# Altium schematic sheet FMC_SFP_ADAPTER_SFP.SchDoc: SFP Connector and case, power supply filtering and status flags, 125 MHz clock
size A4; Date: 10.03.2021; DrawnBy: PFH; Engineer: PFH; DocumentNumber: 1; Revision: A; SheetNumber: 2; SheetTotal: 2; Projekt: FMC-to-SFP Adapter; Website: www.fmchub.com; ProjectName: FMC_Single_LPC_Commercial
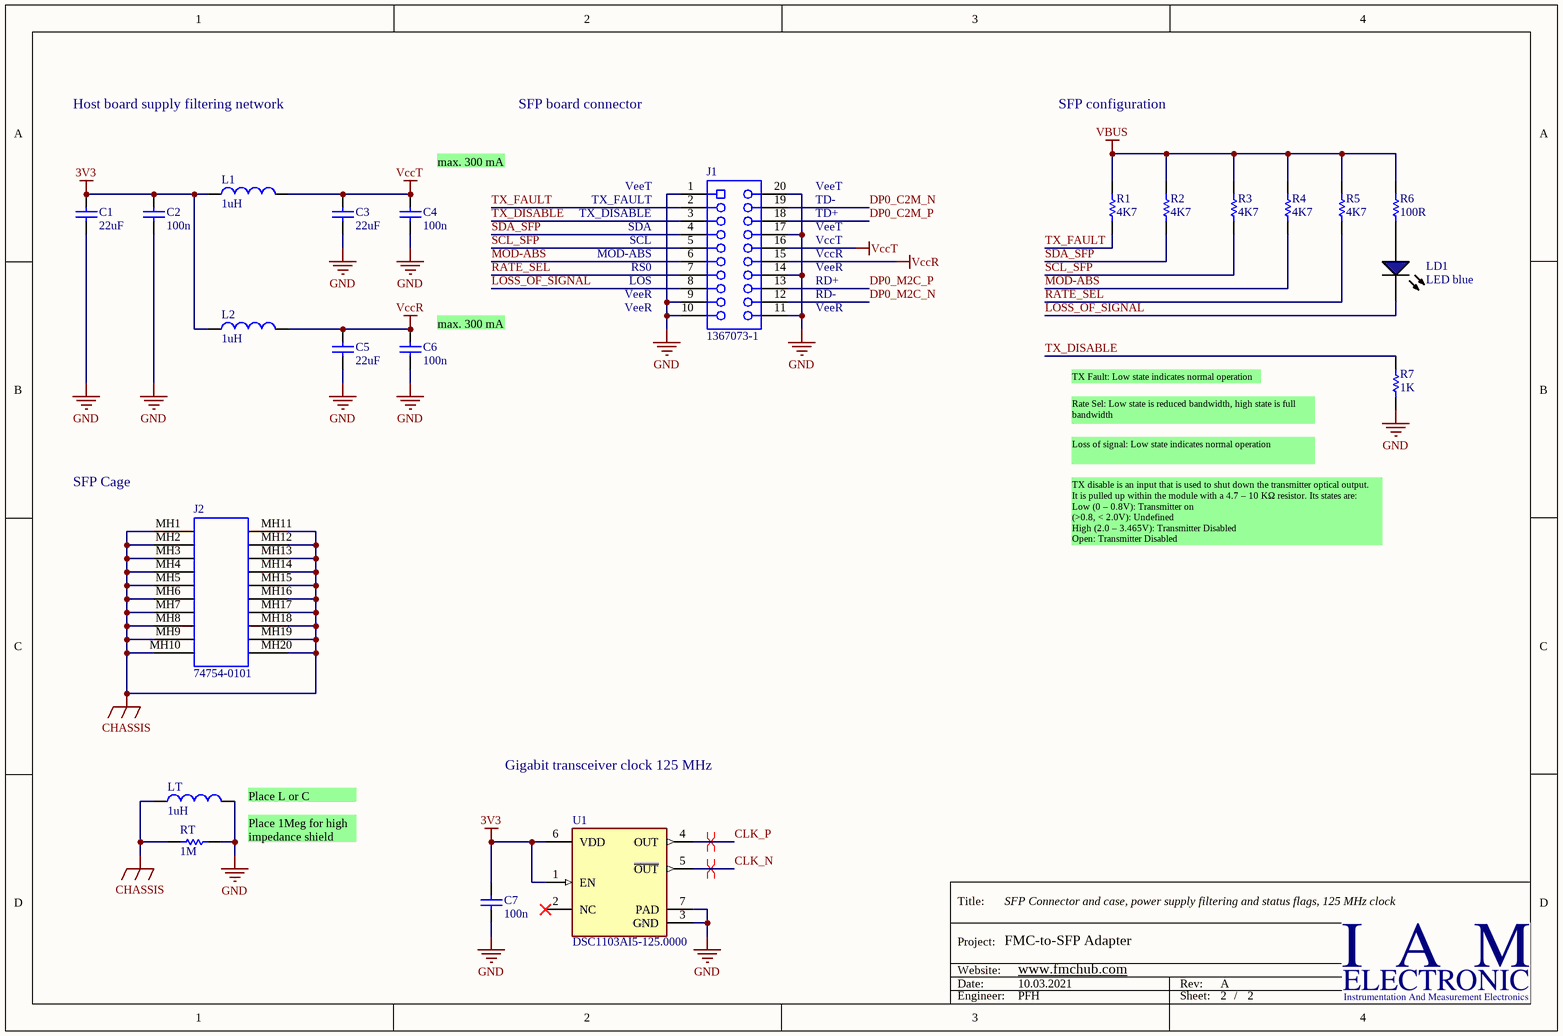
[diagram p0: FMC_SFP_ADAPTER_SFP.SchDoc]

## Parts
C1  22uF  [CAPC1206(3216)190_L]
C2  100n  [CAPC1005X55X25ML05T10]
C3  22uF  [CAPC1206(3216)190_L]
C4  100n  [CAPC1005X55X25ML05T10]
C5  22uF  [CAPC1206(3216)190_L]
C6  100n  [CAPC1005X55X25ML05T10]
C7  100n  [CAPC1005X55X25ML05T10]
J1  1367073-1  [TECO-1367073-1_V]
J2  74754-0101  [MOLX-74754-0101_V]
L1  1uH  [MURA-IND0805_H_0.55_L]
L2  1uH  [MURA-IND0805_H_0.55_L]
LD1  LED blue  [LED0603]
LT  1uH  [MURA-IND0805_H_0.55_L]
R1  4K7  [RESC1005X40X25ML05T05]
R2  4K7  [RESC1005X40X25ML05T05]
R3  4K7  [RESC1005X40X25ML05T05]
R4  4K7  [RESC1005X40X25ML05T05]
R5  4K7  [RESC1005X40X25ML05T05]
R6  100R  [RESC0603(1608)_N]
R7  1K  [RESC1608X55X25NL10T15]
RT  1M  [RESC0805(2012)_L]
U1  DSC1103AI5-125.0000  [FP-C04-1010-MFG]

## Nets
3V3: C1.2 C2.2 C7.1 L1.1 L2.1 U1.1(EN) U1.6(VDD)
CHASSIS: J2.MH1 J2.MH2 J2.MH3 J2.MH4 J2.MH5 J2.MH6 J2.MH7 J2.MH8 J2.MH9 J2.MH10 J2.MH11 J2.MH12 J2.MH13 J2.MH14 J2.MH15 J2.MH16 J2.MH17 J2.MH18 J2.MH19 J2.MH20 LT.1 RT.2
GND: C1.1 C2.1 C3.1 C4.1 C5.1 C6.1 C7.2 J1.1 J1.9 J1.10 J1.11 J1.14 J1.17 J1.20 LT.2 R7.1 RT.1 U1.3(GND) U1.7(PAD)
VBUS: R1.2 R2.2 R3.2 R4.2 R5.2 R6.2
VccR: C5.2 C6.2 J1.15 L2.2
VccT: C3.2 C4.2 J1.16 L1.2
CLK_N: U1.5(~{OUT})
CLK_P: U1.4(OUT)
DP0_C2M_N: J1.19
DP0_C2M_P: J1.18
DP0_M2C_N: J1.12
DP0_M2C_P: J1.13
LOSS_OF_SIGNAL: J1.8 LD1.2(K)
MOD-ABS: J1.6 R4.1
RATE_SEL: J1.7 R5.1
SCL_SFP: J1.5 R3.1
SDA_SFP: J1.4 R2.1
TX_DISABLE: J1.3 R7.2
TX_FAULT: J1.2 R1.1
NetLD1_1: LD1.1(A) R6.1

Not connected (* = marked no-connect by the designer): U1 2(NC)*

## Layout directives
differential pair: CLK_N, CLK_P

## Notes on the sheet
- Host board supply filtering network
- SFP board connector
- SFP configuration
- (near C4) max. 300 mA
- VeeT
- TX_FAULT
- TX_DISABLE
- SDA
- SCL
- TD-
- TD+
- VccT
- MOD-ABS
- RS0
- LOS
- VeeR
- VccR
- RD+
- RD-
- (near C6) max. 300 mA
- TX Fault: Low state indicates normal operation
- Rate Sel: Low state is reduced bandwidth, high state is full bandwidth
- SFP Cage
- Loss of signal: Low state indicates normal operation
- TX disable is an input that is used to shut down the transmitter optical output.
  It is pulled up within the module with a 4.7 – 10 KΩ resistor. Its states are:
  Low (0 – 0.8V): Transmitter on
  (>0.8, < 2.0V): Undefined
  High (2.0 – 3.465V): Transmitter Disabled
  Open: Transmitter Disabled
- Gigabit transceiver clock 125 MHz
- (near LT) Place L or C
- Place 1Meg for high impedance shield
- Title:
- Project:
- Date:
- Website:
- Rev:
- Engineer:
- Sheet:
- /

## Library data of the parts
C1 C3 C5 = CMP-1037-04985-1: CAP 22uF 6.3V X5R ±10% 1206 (3216 Metric) Thickness 1.9mm SMD; Part: JMK316ABJ226KL-T; Manufacturer: Taiyo Yuden; Case-EIA: 1206; Case-Metric: 3216; Tolerance: ±10%; Technology: SMT; Rated Voltage: 6.3V; Max Thickness: 1.9 mm; Value: 22uF
C2 C4 C6 C7 = CMP-2100-03641-1: Chip Capacitor, 0.1 uF, +/- 10%, 16 V, -55 to 125 degC, 0402 (1005 Metric), RoHS, Tape and Reel; Manufacturer: Murata; Part: GRM155R71C104KA88D; Material: Ceramic; Insulation Resistance: 10GR; Voltage: 16V; Dielectric: X7R; Capacitance: 100nF; REACH SVHC: NoSVHC; Depth: 0.5mm; Case/Package: 0402; Datasheet URL: http://psearch.en.murata.com/capacitor/product/GRM155R71C104KA88%23.pdf; Lead Free: LeadFree; Dielectric Material: Ceramic; Manufacturer URL: http://www.murata.com/; Min Operating Temperature: -55degC; Length: 1mm; Case Code (Metric): 1005; Radiation Hardening: No; Package Reference: 0402; RoHSCompliant: true; Datasheet Version: 42675.0; Thickness: 0.022inch; Packaging: TapeandReel; Voltage Rating (DC): 16V; Tolerance: 10%; Max Operating Temperature: 125degC; Package Description: 2-Pin Surface Mount Device, Body 1 x 0.5 mm; Mount: SurfaceMount; Height: 0.5mm; Width: 0.5mm; Number of Pins: 2; Voltage Rating: 16V; Case Code (Imperial): 0402; Termination: SMD/SMT; Package Quantity: 1
J1 = CMP-2000-05488-1: Female Connector, Pitch 0.8 mm, 2 x 10 Position, Height 5.4 mm, -55 to 85 degC, RoHS, Tape and Reel; Manufacturer: TE Connectivity; Product Training Modules: HighSpeedPluggableI/OSolutions; 3D Model: 1367073-1.pdf; Connector Type: SFP; Other Names: A97430DKR; Mating Products: 516-2084-ND / -TXRXOPTICALSFF1.25GBDISCSI; Dynamic Catalog: SFPConnectors; Featured Product: HighSpeedPluggableI-OSolutions; Connector Style: Receptacle; Associated Product: A103997CT-ND / -CONNSFPCAGESINGLEW/OPIPE / A103997TR-ND / -CONNSFPCAGESINGLEW/OPIPE / 1367645-3-ND / -CONNCAGE&HEATSINKSGLPORTTIN / 1367645-2-ND / -CONNCAGE&HEATSINKSGLPORTTIN / 1888424-1-ND / -CONNCAGE1X2SFPENHANCEDEMI / 1367643-1-ND / -CONNCAGESNGLPORTDBLSIDETIN / 1489962-1-ND / -CONNSFPCAGESINGLEW/OPIPE / 1367645-1-ND / -CONNCAGE&HEATSINKSGLPORTTIN / A99375-ND / -CONNSFPCAGE1X4PIN-IN-PASTE / A97412CT-ND / -CONNSFPLOWERCAGEPCB / More...; Number of Positions: 20; Package Reference: 1367073-1; Package Description: Female Connector, Pitch 0.8 mm, 2 x 10 Position, Height 5.4 mm; RoHS Information: 1367073-1StatementofCompliance; Contact Finish: Gold; Datasheet URL: http://www.te.com/commerce/DocumentDelivery/DDEController?Action=showdoc&DocId=Customer+Drawing%7F1367073%7FK%7Fpdf%7FEnglish%7FENG_CD_1367073_K.pdf%7F1367073-1; Datasheet Version: Rev. K, 12/2012; Contact Finish Thickness: 15µin(0.38µm); Category: Connectors,Interconnects; Mounting Type: SurfaceMount,RightAngle; Mounting Technology: SurfaceMount; Packaging: Digi-Reel®; Manufacturer URL: http://www.te.com/; Family: PluggableConnectors; Standard Package: 1; Termination: Solder; Part: 1367073-1
J2 = CMP-1704-00003-3: SFP+ Cage, Single Port, Height 10.85 mm, Tail Height 3.05 mm, -40 to 85 degC, RoHS, Tray; Manufacturer: Molex; RoHSCompliant: True; ComponentLink3URL: http://www.molex.com/pdm_docs/sd/747540101_sd.pdf; Width: 49 mm; Height: 10.85 mm; Mounting Technology: Through Hole; ComponentLink2Description: Datasheet; ComponentLink3Description: Package Specification; DatasheetVersion: Rev. Jul-15; Package Quantity: 1152; PackageDescription: SFP+ Cage, Single Port, Height 10.85 mm, Tail Height 3.05 mm; Radiation Hardening: No; PackageVersion: Rev. J, 02/2015; ComponentLink1Description: Manufacturer URL; PartNumber: 74754-0101; ComponentLink1URL: http://www.molex.com/; Packaging: Tray; Length: 15.9 mm; ComponentLink2URL: http://www.molex.com/webdocs/datasheets/pdf/en-us/0747540101_IO_CONNECTORS.pdf; Part: 74754-0101
L1 L2 LT = CMP-2000-06589-1: Chip Inductor, 1.0 uH, +/- 20%, -55 to 125 degC, 2-Pin SMD (0805), RoHS, Tape and Reel; Manufacturer: Murata; Part: LQM21PN1R0MC0D; Rated Current-Max: 800mA; Inductance-Nom: 1H; DC Resistance: 0.19; Mounting Technology: SurfaceMount; Package Reference: 0805; Tolerance (%): 20%; Datasheet Version: 07/2014; Manufacturer URL: http://www.murata.com/; Package Description: 2-Pin Surface Mounted Device, Body 2 x 1.25 mm; Case Size/Dimension: 0805; Datasheet URL: https://datasheet.ciiva.com/3866/336lqm21pn1r0mc023-3866307.pdf
LD1 = LED_BLUE: LED blue, SMD 0603; Part: LTST-C190TBKT; Manufacturer: Lite-On; Voltage: 3.1 V; Color: blue
R1-R5 = CMP-2002-00051-2: Chip Resistor, 4.7 KOhm, +/- 1%, 63 mW, -55 to 155 degC, 0402 (1005 Metric), RoHS, Tape and Reel; PartNumber: CRCW04024K70FKED; Manufacturer: Vishay; Power Rating: 63 mW; Voltage Rating: 50 V; Length: 1 mm; Mount: Surface Mount; Case Code (Metric): 1005; ComponentLink1Description: Datasheet; Package Quantity: 10000; Case Code (Imperial): 0402; Max Operating Temperature: 155 degC; Case/Package: 0402; REACH SVHC: Unknown; PackageDescription: 2-Pin Surface Mount Device, Body 1 x 0.5 mm; Width: 0.5 mm; Min Operating Temperature: -55 degC; Resistance: 4.7 KOhm; Height: 0.35 mm; Packaging: Tape and Reel; Mounting Technology: Surface Mount; Tolerance: 1%; RoHSCompliant: True; ComponentLink1URL: http://www.vishay.com/docs/20035/dcrcwe3.pdf; Part: CRCW04024K70FKED
R6 = CMP-1012-00397-1: 100R 0.1W 1% 0603 (1608 Metric)  SMD; Part: RC0603FR-07100RL; Manufacturer: Yageo; Value: 100.00 Ohm; Case-EIA: 0603; Case-Metric: 1608; Technology: SMT; Tolerance: 1 %; Power: 0.1 W
R7 = CMP-1659-00009-4: Chip Resistor, 1 KOhm, +/-1%, 0.1 W, -55 to 155 degC, 0603 (1608 Metric), RoHS, Tape and Reel; Manufacturer: Yageo; Part: RC0603FR-071KL; Voltage Rating: 50 V; ComponentLink2URL: http://www.yageo.com/documents/recent/PYu-RC_Group_51_RoHS_L_04.pdf; Max Operating Temperature: 155 degC; PackageDescription: 2-Pin Surface Mount Device, Body 1.6 x 0.8 mm; Packaging: Tape and Reel; ComponentLink3Description: Package Specification; REACH SVHC: No SVHC; Mount: Surface Mount; ComponentLink2Description: Datasheet; Length: 1.6 mm; PackageReference: 0603; Height: 0.45 mm; DatasheetVersion: Rev. 4, 02/2016; Min Operating Temperature: -55 degC; ComponentLink1Description: Manufacturer URL; Package Quantity: 200; RoHSCompliant: true; ComponentLink3URL: http://www.farnell.com/datasheets/443971.pdf; Pins: 2; Mounting Technology: Surface Mount; ComponentLink1URL: http://www.yageo.com/
RT = CMP-1013-00146-1: Part: RC0805JR-071ML; Manufacturer: Yageo; Case-Metric: 2012; Tolerance: 5 %; Value: 1000000.00 Ohm; Power: 0.125 W; Case-EIA: 0805; Technology: SMT
U1 = CMP-06255-000001-1: MEMS OSC XO 125.0000MHZ LVDS SMD; Manufacturer: Microchip; Standoff Height: 0mm; Min Supply Voltage: 2.25V; Max Supply Voltage: 3.63V; Frequency: 125MHz; Max Supply Current: 32mA; Stability: 10ppm; Max Junction Temp: +150°C; Ipc Land Pattern Name: DFN700X500X85-6; ComponentLink2Description: Datasheet; Series: DSC1103; RoHS: TRUE; Temperature Range High: +105°C; Device Class L1: Passive Components; Automotive: No; Height: 0.9mm; Temperature Range Low: -40°C; ComponentLink2URL: http://ww1.microchip.com/downloads/en/DeviceDoc/DSC1103-23-Low-Jitter-Precision-LVDS-Oscillator-DS20005745B.pdf; Device Class L3: Oscillators; Ambient Temperature Range High: +105°C; Digikey Description: MEMS OSC XO 125.0000MHZ LVDS SMD; Lead Free: Yes; Device Class L2: Crystals / Oscillators; Octopart: https://octopart.com/dsc1103al1-100.0000-microchip-87209273; Category: Crys; Package: C04-1010; Ambient Temperature Range Low: -40°C; Manufacturer Part Number: DSC1103AI5-125.0000; Temperature: -40°C to +105°C; Part: DSC1103AI5-125.0000